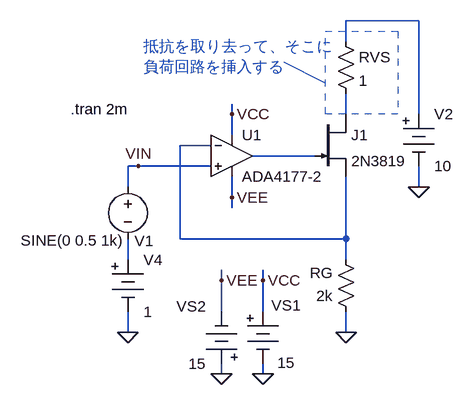
[diagram p0: schematic fig-01-02-28.asc]
fig-01-02-28.asc, the LTspice schematic file:
Version 4
SHEET 1 880 680
WIRE 496 -32 384 -32
WIRE 384 0 384 -32
WIRE 208 112 208 96
WIRE 384 112 384 80
WIRE 496 112 496 -32
WIRE 208 144 208 112
WIRE 176 160 128 160
WIRE 336 176 240 176
WIRE 64 192 48 192
WIRE 176 192 64 192
WIRE 48 224 48 192
WIRE 496 224 496 192
WIRE 208 240 208 208
WIRE 208 256 208 240
WIRE 128 304 128 160
WIRE 384 304 384 208
WIRE 384 304 128 304
WIRE 48 336 48 304
WIRE 384 336 384 304
WIRE 192 368 192 352
WIRE 256 368 256 352
WIRE 192 416 192 368
WIRE 256 416 256 368
WIRE 48 448 48 416
WIRE 384 448 384 416
WIRE 192 512 192 496
WIRE 256 512 256 496
FLAG 384 448 0
FLAG 48 448 0
FLAG 64 192 VIN
FLAG 496 224 0
FLAG 192 512 0
FLAG 256 512 0
FLAG 192 368 VEE
FLAG 256 368 VCC
FLAG 208 112 VCC
FLAG 208 240 VEE
SYMBOL res 400 432 R180
WINDOW 0 36 76 Left 2
WINDOW 3 36 40 Left 2
SYMATTR InstName RG
SYMATTR Value 2k
SYMBOL voltage 48 208 R0
WINDOW 0 10 99 Left 2
WINDOW 3 -165 98 Left 2
WINDOW 123 0 0 Left 0
WINDOW 39 0 0 Left 0
SYMATTR InstName V1
SYMATTR Value SINE(0 0.5 1k)
SYMBOL Misc\\battery 496 96 R0
WINDOW 123 0 0 Left 0
WINDOW 39 0 0 Left 0
SYMATTR InstName V2
SYMATTR Value 10
SYMBOL Misc\\battery 256 400 R0
WINDOW 0 13 6 Left 2
WINDOW 3 22 95 Left 2
SYMATTR InstName VS1
SYMATTR Value 15
SYMBOL Misc\\battery 192 512 R180
WINDOW 0 24 104 Left 2
WINDOW 3 24 16 Left 2
SYMATTR InstName VS2
SYMATTR Value 15
SYMBOL res 368 -16 R0
SYMATTR InstName RVS
SYMATTR Value 1
SYMBOL njf 336 112 R0
SYMATTR InstName J1
SYMATTR Value 2N3819
SYMBOL Misc\\battery 48 320 R0
WINDOW 123 0 0 Left 0
WINDOW 39 0 0 Left 0
SYMATTR InstName V4
SYMATTR Value 1
SYMBOL Opamps\\ADA4177-2 208 176 R0
SYMATTR InstName U1
TEXT -40 104 Left 2 !.tran 2m
TEXT 72 8 Left 2 ;抵抗を取り去って、そこに\n負荷回路を挿入する
LINE Normal 288 32 352 64
RECTANGLE Normal 464 112 352 -16 2

The netlist it stands for:
* fig-01-02-28.asc
RG 0 N003 2k
V1 VIN N005 SINE(0 0.5 1k)
V2 N001 0 10
VS1 VCC 0 15
VS2 0 VEE 15
RVS N001 N002 1
J1 N002 N004 N003 2N3819
V4 N005 0 1
* U1: ADA4177-2 (symbol Opamps\ADA4177-2 not available, pins judged from their places): In+=VIN In-=N003 V+=VCC V-=VEE OUT=N004
.model NJF NJF
.model PJF PJF
.lib standard.jft
.tran 2m
* 抵抗を取り去って、そこに
* 負荷回路を挿入する
.backanno
.end